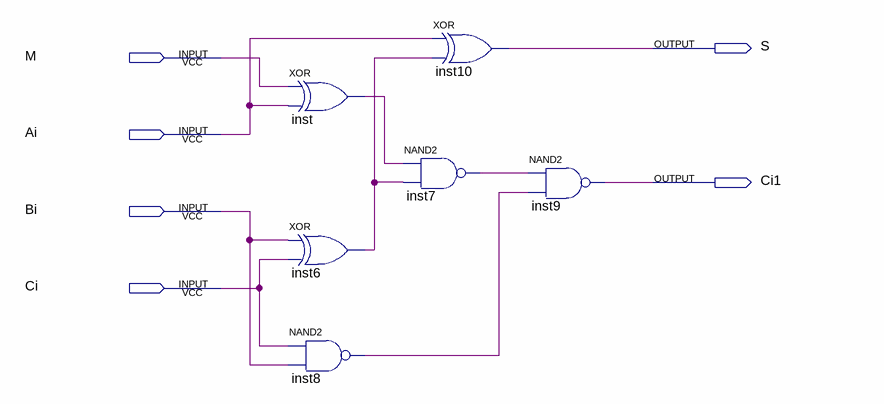
[diagram p0: schematic sheet]
// Quartus schematic Block1.bdf as structural Verilog: 6 symbols, 6 pins
module Block1 (
  input  M,
  input  Ai,
  input  Bi,
  input  Ci,
  output S,
  output Ci1
);

  wire inst6_out, inst7_out, inst8_out, inst_out;

  xor inst (inst_out, M, Ai);
  xor inst6 (inst6_out, Bi, Ci);
  nand inst8 (inst8_out, Ci, Bi);
  xor inst10 (S, Ai, inst6_out);
  nand inst7 (inst7_out, inst_out, inst6_out);
  nand inst9 (Ci1, inst7_out, inst8_out);
endmodule
